# EAGLE design cutOffMosfetOLD (EAGLE 8.2.2)
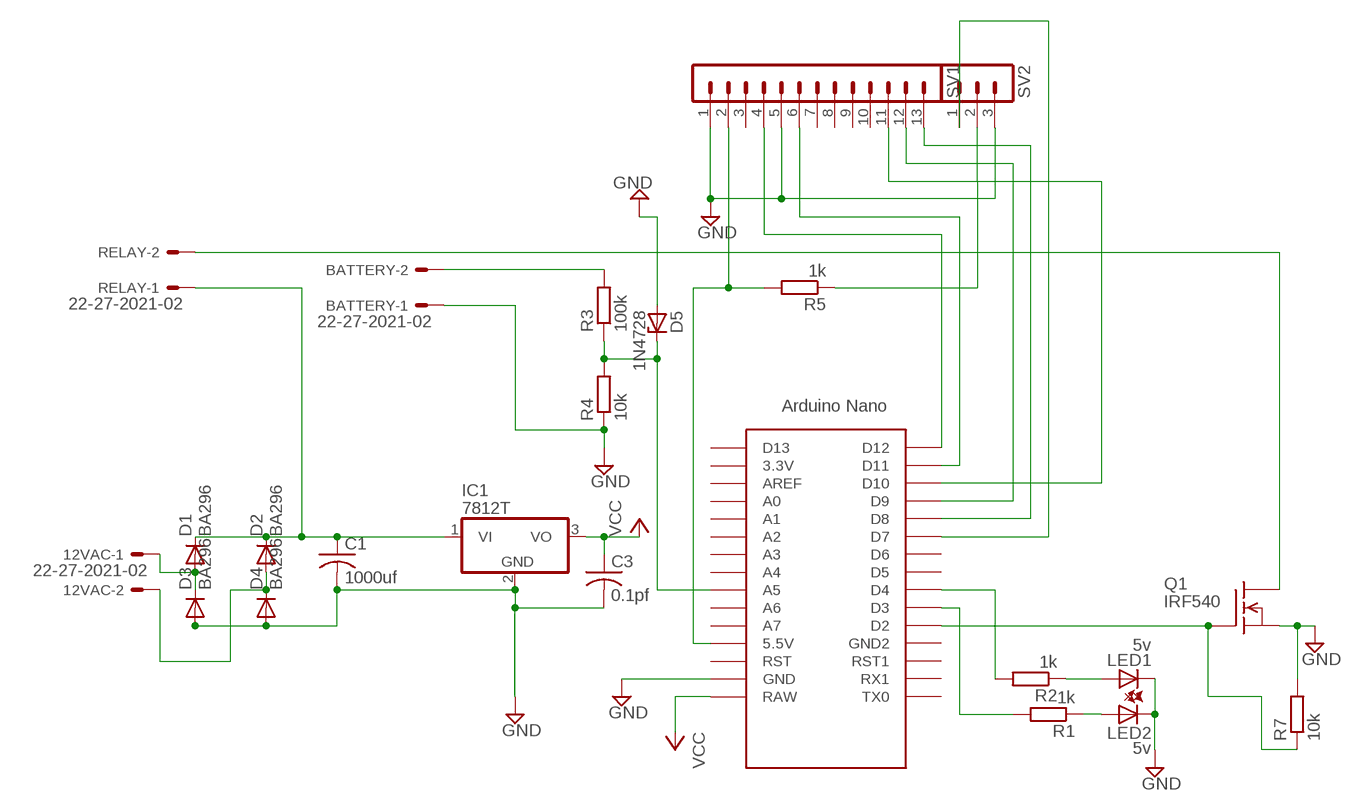
[diagram p0: schematic, sheet 1]

## Parts
12VAC  22-27-2021-02  [6410-02]
BATTERY  22-27-2021-02  [6410-02]
C1  1000uf  C-US050-025X075  [C050-025X075]
C3  0.1pf  C-US050-025X075  [C050-025X075]
D1  BA296  [P2-15]
D2  BA296  [P2-15]
D3  BA296  [P2-15]
D4  BA296  [P2-15]
D5  1N4728  [DO41Z10]
IC1  7812T  [TO220H]
LED1  5v  LED5MM  [LED5MM]
LED2  5v  LED5MM  [LED5MM]
Q1  IRF540  [TO220]
R1  1k  R0207/10  [0207/10]
R2  1k  R0207/10  [0207/10]
R3  100k  R0207/10  [0207/10]
R4  10k  R0207/10  [0207/10]
R5  1k  R0207/10  [0207/10]
R7  10k  R0207/10  [0207/10]
RELAY  22-27-2021-02  [6410-02]
SV1  MA13-1  [MA13-1]
SV2  MA03-1  [MA03-1]
U$1  NANO  [NANO]

## Nets
GND: BATTERY.1 C1.2 C3.2 D3.A D4.A D5.A IC1.2(GND) LED1.K(C) LED2.K(C) Q1.3(S) R4.1 R7.2 SV1.1 SV1.5 SV2.3 U$1.GND
N$1: Q1.2(D) RELAY.2
N$2: R1.2 U$1.D3
N$3: R2.2 U$1.D4
N$4: BATTERY.2 R3.2
N$5: 12VAC.1 D1.A D3.C
N$6: 12VAC.2 D2.A D4.C
N$7: SV1.6 U$1.D11
N$8: LED2.A R1.1
N$9: LED1.A R2.1
N$10: SV1.11 U$1.D10
N$11: Q1.1(G) R7.1 U$1.D2
N$12: SV1.12 U$1.D9
N$13: D5.C R3.1 R4.2 U$1.A5
N$14: R5.1 SV2.2
N$15: SV1.4 U$1.D12
N$16: SV1.13 U$1.D8
N$17: C1.1 D1.C D2.C IC1.1(VI) RELAY.1
N$18: SV2.1 U$1.D7
N$19: R5.2 SV1.2 U$1.5V(5.5V)
VCC: C3.1 IC1.3(VO) U$1.RAW
Unconnected: SV1.3 SV1.7 SV1.8 SV1.9 SV1.10 U$1.3.3V U$1.A0 U$1.A1 U$1.A2 U$1.A3 U$1.A4 U$1.A6 U$1.A7 U$1.AREF U$1.D5 U$1.D6 U$1.D13 U$1.GND1(GND2) U$1.ICSP1 U$1.ICSP2 U$1.ICSP3 U$1.ICSP4 U$1.ICSP5 U$1.ICSP6 U$1.RST U$1.RST1 U$1.RX1 U$1.TX0

## Library data of the parts
12VAC BATTERY RELAY = con-molex:22-?-02: CONNECTOR wire to board 2.54 mm (.1 inch) pitch header; OC_FARNELL: unknown; OC_NEWARK: unknown
C1 C3 = rcl:C-US: CAPACITOR, American symbol; C1: 1000uf
D1-D4 = diode:BA296: DIODE
D5 = diode:1N4728: Z DIODE 3.3 V, 1W, 5 percent
IC1 = linear:78*: Positive VOLTAGE REGULATOR Source: http://cache.national.com/ds/LM/LM78L05.pdf http://www.fairchildsemi.com/ds/LM/LM7805.pdf
LED1 LED2 = led:LED: LED OSRAM: - CHIPLED LG R971, LG N971, LY N971, LG Q971, LY Q971, LO R971, LY R971 LH N974, LH R974 LS Q976, LO Q976, LY Q976 LO Q996 - Hyper CHIPLED LW Q18S LB Q993, LB Q99A, LB R99A - SideLED LS A670, LO A670, LY A670, LG A670, LP A670 LB A673, LV A673, LT A673, LW A673 LH A674 LY A675 LS A676, LA A676, LO A676, LY A676, LW A676 LS A679, LY A679, LG A679 - Hyper Micro SIDELED® LS Y876, LA Y876, LO Y876, LY Y876 LT Y87S - SmartLED LW L88C, LW L88S LB L89C, LB L89S, LG L890 LS L89K, LO L89K, LY L89K LS L896, LA L896, LO L896, LY L896 - TOPLED LS T670, LO T670, LY T670, LG T670, LP T670 LSG T670, LSP T670, LSY T670, LOP T670, LYG T670 LG T671, LOG T671, LSG T671 LB T673, LV T673, LT T673, LW T673 LH T674 LS T676, LA T676, LO T676, LY T676, LB T676, LH T676, LSB T676, LW T676 LB T67C, LV T67C, LT T67C, LS T67K, LO T67K, LY T67K, LW E67C LS E67B, LA E67B, LO E67B, LY E67B, LB E67C, LV E67C, LT E67C LW T67C LS T679, LY T679, LG T679 LS T770, LO T770, LY T770, LG T770, LP T770 LB T773, LV T773, LT T773, LW T773 LH T774 LS E675, LA E675, LY E675, LS T675 LS T776, LA T776, LO T776, LY T776, LB T776 LHGB T686 LT T68C, LB T68C - Hyper Mini TOPLED® LB M676 - Mini TOPLED Santana® LG M470 LS M47K, LO M47K, LY M47K Source: http://www.osram.convergy.de LUXEON: - LUMILED® LXK2-PW12-R00, LXK2-PW12-S00, LXK2-PW14-U00, LXK2-PW14-V00 LXK2-PM12-R00, LXK2-PM12-S00, LXK2-PM14-U00 LXK2-PE12-Q00, LXK2-PE12-R00, LXK2-PE12-S00, LXK2-PE14-T00, LXK2-PE14-U00 LXK2-PB12-K00, LXK2-PB12-L00, LXK2-PB12-M00, LXK2-PB14-N00, LXK2-PB14-P00, LXK2-PB14-Q00 LXK2-PR12-L00, LXK2-PR12-M00, LXK2-PR14-Q00, LXK2-PR14-R00 LXK2-PD12-Q00, LXK2-PD12-R00, LXK2-PD12-S00 LXK2-PH12-R00, LXK2-PH12-S00 LXK2-PL12-P00, LXK2-PL12-Q00, LXK2-PL12-R00 Source: www.luxeon.com KINGBRIGHT: KA-3528ASYC Source: www.kingbright.com
Q1 = transistor-fet:IRF540: N-Channel Enhancement MOSFET (HEXFET); 100V; 28A; 0,077Ohm
R1-R5 R7 = eagle-ltspice:R: RESISTOR, European symbol; SPICEMODEL: NONE; SPICEPREFIX: R
SV1 = con-lstb:MA13-1: PIN HEADER; OC_FARNELL: unknown; OC_NEWARK: unknown
SV2 = con-lstb:MA03-1: PIN HEADER; OC_FARNELL: unknown; OC_NEWARK: unknown
U$1 = Arduino-clone:NANO: Arduino Nano

## Net classes
0 mine: width 0.762 mm, drill 1.016 mm, clearance 0.254 mm

## Board
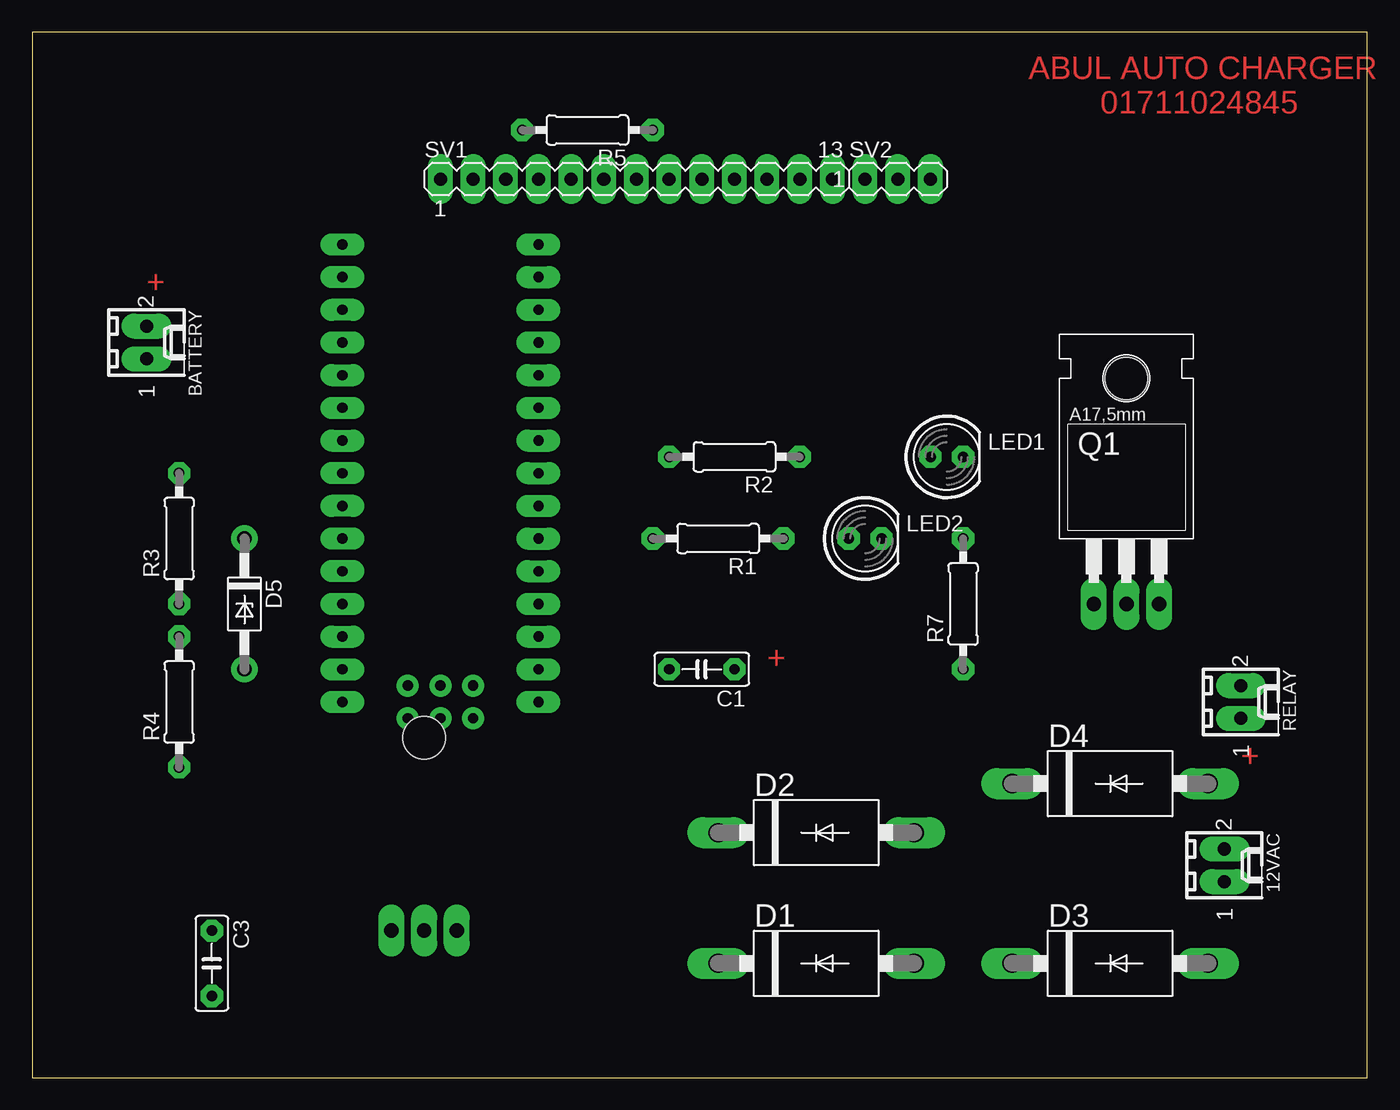
[diagram p1: board, top side]
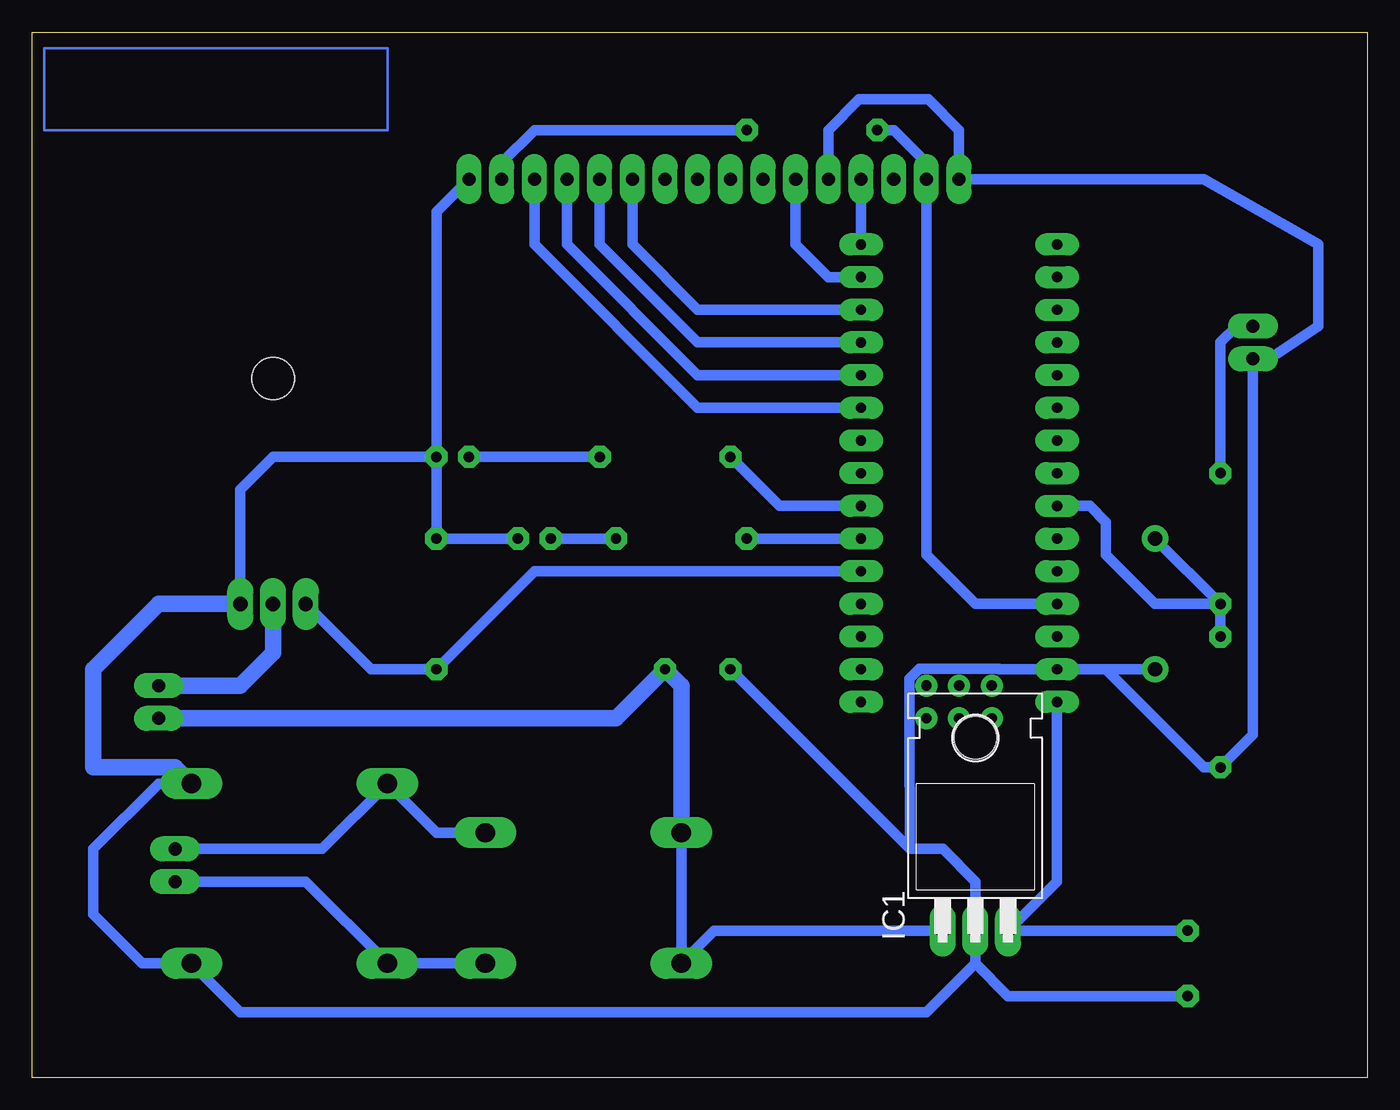
[diagram p2: board, bottom side, seen from below]

Size 103.81 x 81.27 mm. Coordinates in mm from the lower left corner, seen from the top.
Outline: 0,0 103.81,0 103.81,81.27 0,81.27 0,0
Copper layers (1*16): Top 0.035mm / dielectric 1.5mm / Bottom 0.035mm
Design rules "default *": minimum track width 6mil, minimum drill 0.35mm, track to track 20mil, track to pad 10mil, pad to pad 10mil, via to via 6mil, smd to smd 6mil, copper to edge 40mil, drill to drill 6mil, minimum pad ring 18mil, minimum via ring 8mil, stop-mask expansion 4mil, vias tented up to drill 0mil, thermal gap 10mil

### Footprints (pad centres in the part's own frame; a part is rotated, then mirrored left to right if it is on the bottom)
6410-02 = drill 1.016 long: 1 1.27,0; 2 -1.27,0
C050-025X075 = drill 0.813 octagon: 1 -2.54,0; 2 2.54,0
P2-15 = drill 1.499 long: A 7.62,0; C -7.62,0
DO41Z10 = drill 1.118: A 5.08,0; C -5.08,0
TO220H = drill 1.118 long: 1 -2.54,-10.16; 2 0,-10.16; 3 2.54,-10.16 | hole 3.302: 0,4.826
LED5MM = drill 0.813 octagon: A -1.27,0; K 1.27,0
TO220 = drill 1.118 long: 1 -2.54,-6.35; 2 0,-6.35; 3 2.54,-6.35 | hole 3.302: 0,11.176
0207/10 = drill 0.813 octagon: 1 -5.08,0; 2 5.08,0
MA13-1 = drill 1.016 long: 1 -15.24,0; 2 -12.7,0; 3 -10.16,0; 4 -7.62,0; 5 -5.08,0; 6 -2.54,0; 7 0,0; 8 2.54,0; 9 5.08,0; 10 7.62,0; 11 10.16,0; 12 12.7,0; 13 15.24,0
MA03-1 = drill 1.016 long: 1 -2.54,0; 2 0,0; 3 2.54,0
NANO = drill 0.8 long: 3.3V -10.16,24.13; 5V -10.16,-1.27; A0 -10.16,19.05; A1 -10.16,16.51; A2 -10.16,13.97; A3 -10.16,11.43; A4 -10.16,8.89; A5 -10.16,6.35; A6 -10.16,3.81; A7 -10.16,1.27; AREF -10.16,21.59; D2 5.08,1.27; D3 5.08,3.81; D4 5.08,6.35; D5 5.08,8.89; D6 5.08,11.43; D7 5.08,13.97; D8 5.08,16.51; D9 5.08,19.05; D10 5.08,21.59; D11 5.08,24.13; D12 5.08,26.67; D13 -10.16,26.67; GND -10.16,-6.35; GND1 5.08,-1.27; RAW -10.16,-8.89; RST -10.16,-3.81; RST1 5.08,-3.81; RX1 5.08,-6.35; TX0 5.08,-8.89 | drill 0.8: ICSP1 -5.08,-10.16; ICSP2 -5.08,-7.62; ICSP3 -2.54,-10.16; ICSP4 -2.54,-7.62; ICSP5 0,-10.16; ICSP6 0,-7.62

### Placement (x,y rotation side)
12VAC  92.71,16.51 270 top
BATTERY  8.89,57.15 270 top
C1  52.07,31.75 180 top
C3  13.97,8.89 270 top
D1  60.96,8.89 0 top
D2  60.96,19.05 0 top
D3  83.82,8.89 0 top
D4  83.82,22.86 0 top
D5  16.51,36.83 270 top
IC1  30.48,21.59 0 bottom
LED1  71.12,48.26 0 top
LED2  64.77,41.91 0 top
Q1  85.09,43.18 0 top
R1  53.34,41.91 180 top
R2  54.61,48.26 180 top
R3  11.43,41.91 90 top
R4  11.43,29.21 90 top
R5  43.18,73.66 180 top
R7  72.39,36.83 90 top
RELAY  93.98,29.21 270 top
SV1  46.99,69.85 0 top
SV2  67.31,69.85 0 top
U$1  34.29,38.1 0 top

### Tracks (layer width: path | path; a pad name or v marks a point on that pad's centre or on a via)
GND
  Bottom 0.813: D4.A 93.98,22.86 99.06,17.78 99.06,12.7 95.25,8.89 D3.A 87.63,5.08 34.29,5.08 30.48,8.89 | Q1.3 88.06,36.83 87.63,37.26 87.63,45.72 85.09,48.26 LED1.K | 20.32,31.75 12.7,24.13 R4.1 8.89,26.67 8.89,55.53 | 20.32,31.75 U$1.GND 28.62,31.75 28.67,31.79 34.83,31.79 35.6,31.02 35.6,29.94 35.6,28.49 35.6,28.48 35.6,27.4 35.59,27.38 35.56,17.78 | 8.89,55.53 BATTERY.1 7.62,55.88 3.81,58.42 3.81,64.77 12.7,69.85 SV1.1 31.75,73.66 34.13,76.04 39.53,76.04 41.91,73.66 SV1.5 | LED1.K 72.39,67.31 SV2.3 | 8.54,55.88 8.89,55.53 | LED2.K R7.2 LED1.K | 35.56,17.78 C1.2 | 35.56,17.78 33.02,17.78 30.48,15.24 IC1.2 30.48,8.89 | 30.48,8.89 27.94,6.35 C3.2 | D5.A 20.32,31.75
  Bottom 1.27: Q1.3 93.98,36.83 99.06,31.75 99.06,24.13 92.71,24.13 D4.A
N$1
  Bottom 1.27: Q1.2 85.09,33.02 87.63,30.48 RELAY.2
N$2
  Bottom 0.813: U$1.D3 R1.2
N$3
  Bottom 0.813: U$1.D4 45.72,44.45 R2.2
N$4
  Bottom 0.813: BATTERY.2 10.16,58.42 11.43,57.15 R3.2
N$5
  Bottom 0.813: D1.A D3.C 82.55,15.24 12VAC.1
N$6
  Bottom 0.813: D2.A 72.39,19.05 D4.C 81.28,17.78 12VAC.2
N$7
  Bottom 0.813: U$1.D11 41.91,62.23 44.45,64.77 SV1.6
N$8
  Bottom 0.813: R1.1 LED2.A
N$9
  Bottom 0.813: R2.1 LED1.A
N$10
  Bottom 0.813: U$1.D10 52.07,59.69 57.15,64.77 SV1.11
N$11  (via drill 0.35 pad 0.9)
  Top 0.813: R7.1 v72.47,31.83
  Bottom 0.813: R7.1 v72.47,31.83 | R7.1 77.47,31.75 Q1.1 | U$1.D2 64.77,39.37 R7.1
N$12
  Bottom 0.813: U$1.D9 52.07,57.15 59.69,64.77 SV1.12
N$13
  Bottom 0.813: R3.1 R4.2 | D5.C R3.1 | U$1.A5 21.59,44.45 20.32,43.18 20.32,40.64 16.51,36.83 R3.1
N$14
  Bottom 0.813: R5.1 64.77,73.66 67.31,71.12 SV2.2
N$15
  Bottom 0.813: U$1.D12 SV1.4
N$16
  Bottom 0.813: U$1.D8 52.07,54.61 62.23,64.77 SV1.13
N$17
  Bottom 0.813: IC1.1 50.8,11.43 D1.C D2.C
  Bottom 1.27: RELAY.1 58.42,27.94 C1.1 53.34,30.48 D2.C
N$18
  Bottom 0.813: U$1.D7 52.07,52.07 64.77,64.77 SV2.1
N$19
  Bottom 0.813: R5.2 36.83,73.66 34.29,71.12 SV1.2 34.29,40.64 30.48,36.83 U$1.5V
N$20
  Bottom 0.203: 76.2,80.01 76.2,73.66 102.87,73.66 102.87,80.01 76.2,80.01
VCC
  Bottom 0.813: U$1.RAW 24.13,15.24 IC1.3 C3.1

### Text on the board
Top: ABUL AUTO CHARGER / 01711024845 | + | + | +